# EAGLE design rizon_io (EAGLE 8.4.1)
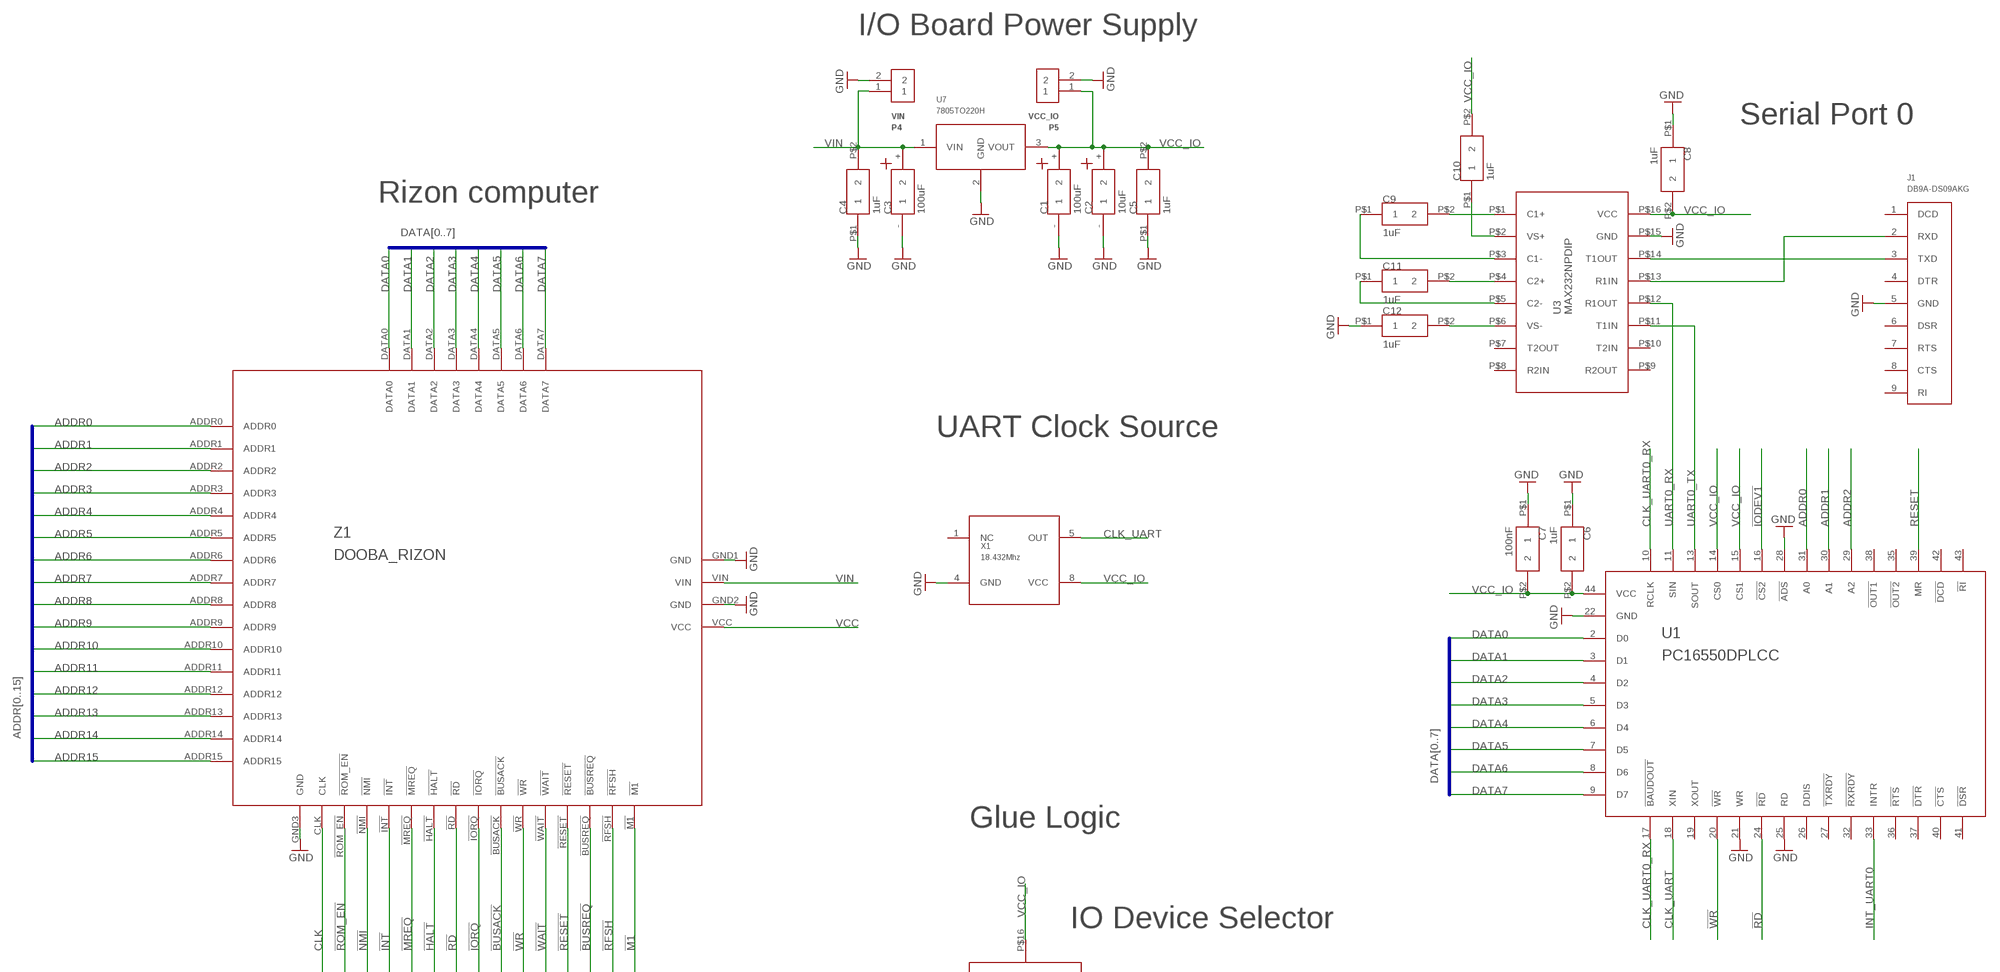
[diagram p0: schematic, sheet 1, part 1 of 3]
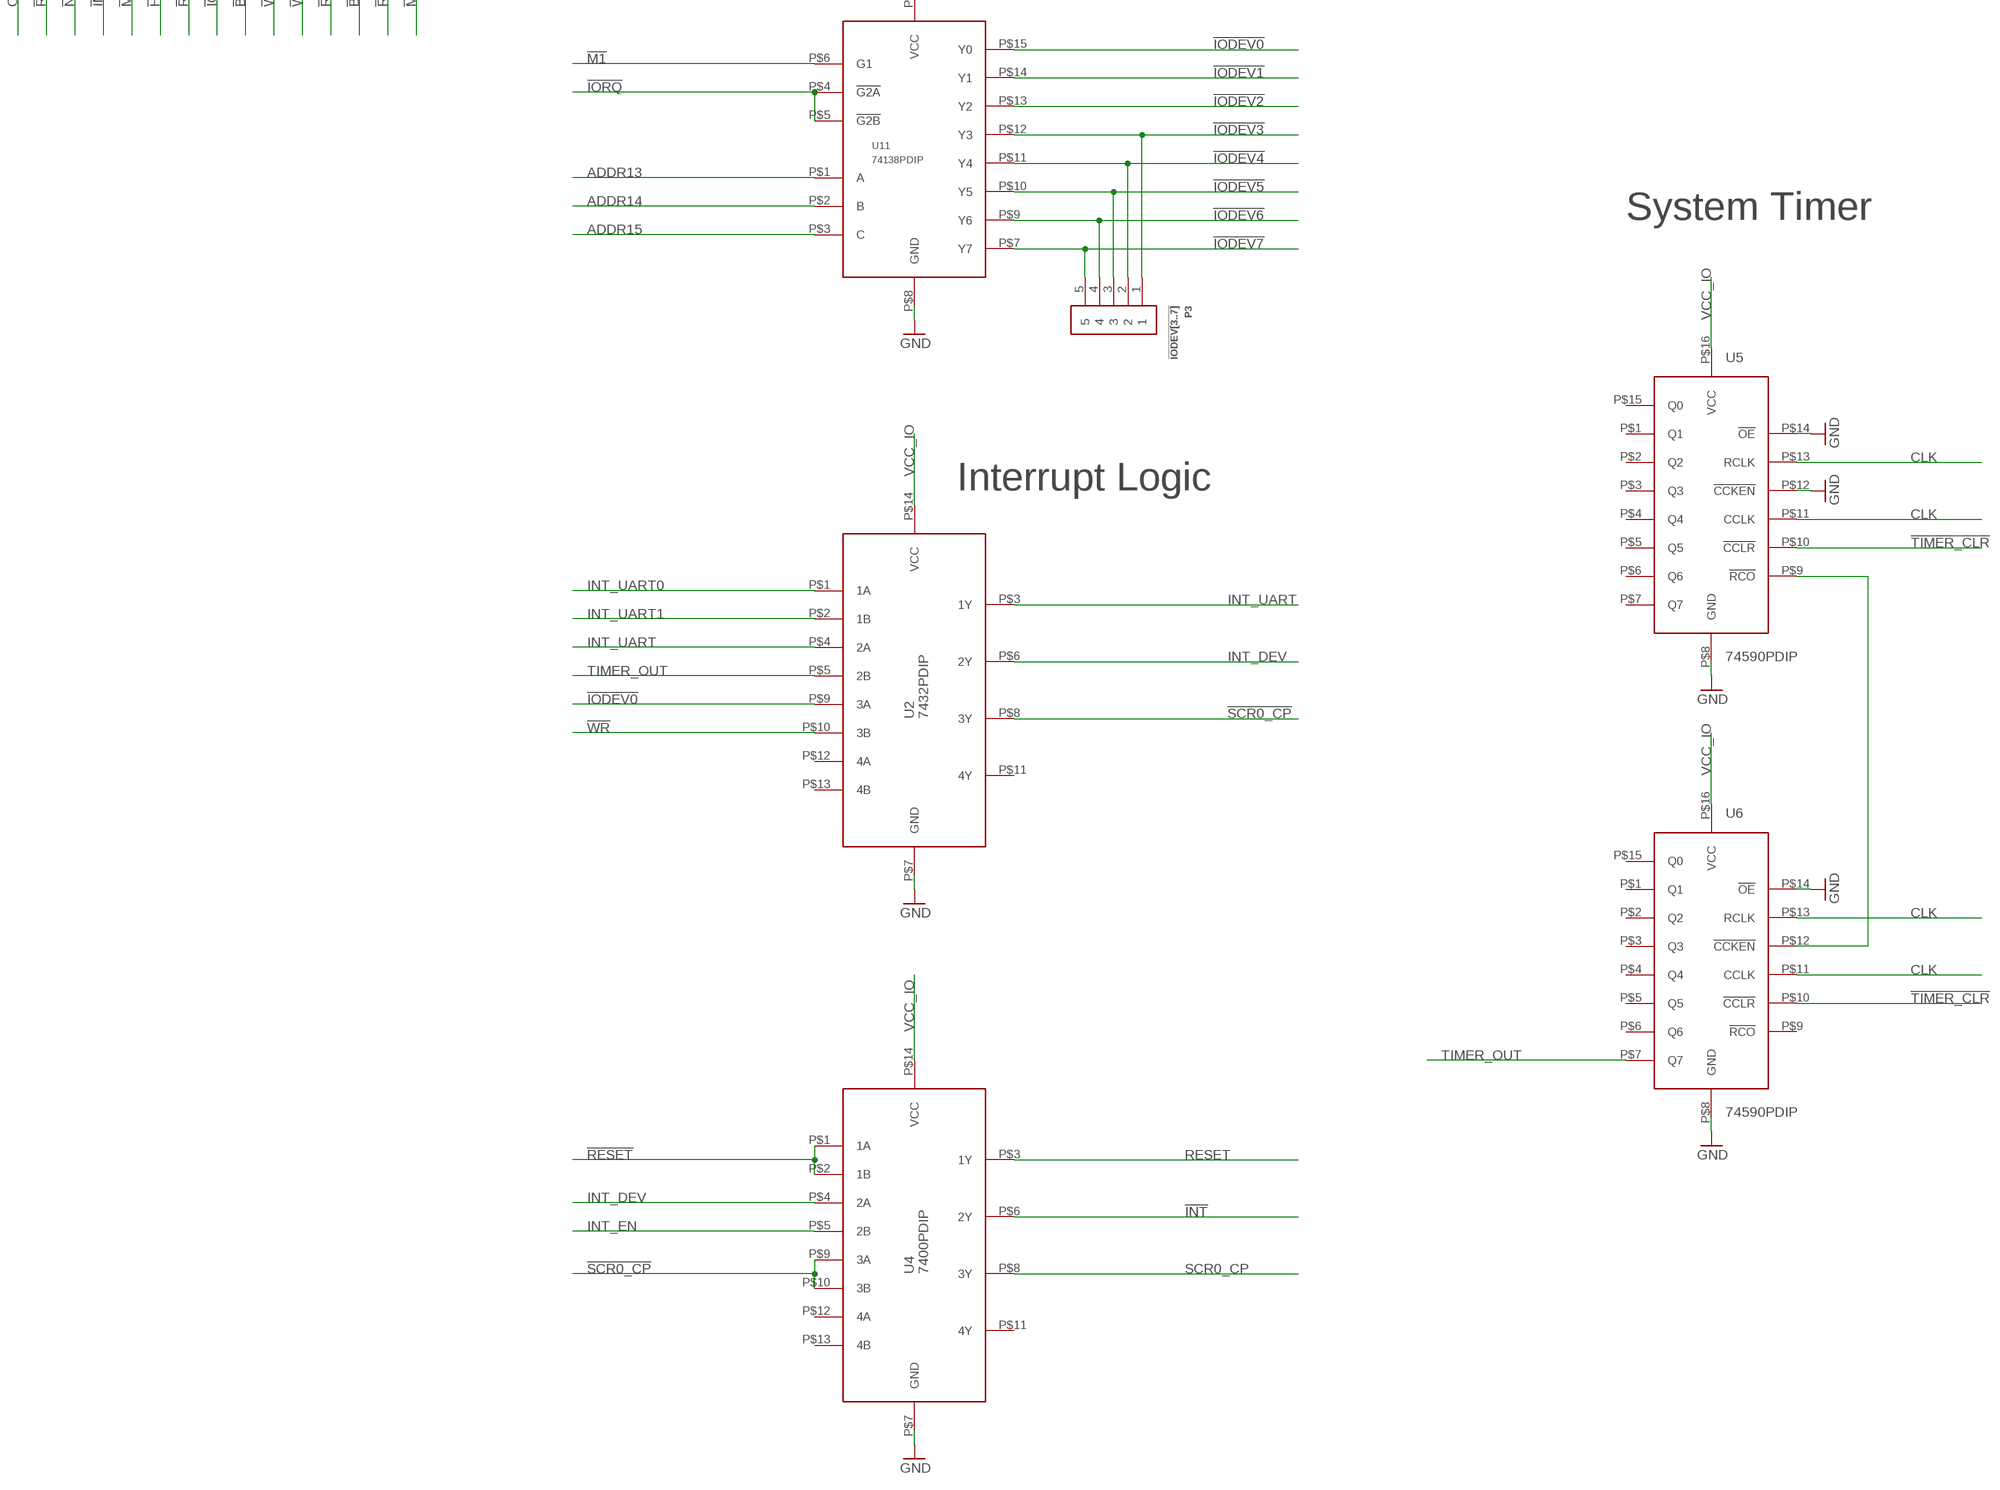
[diagram p1: schematic, sheet 1, part 2 of 3]
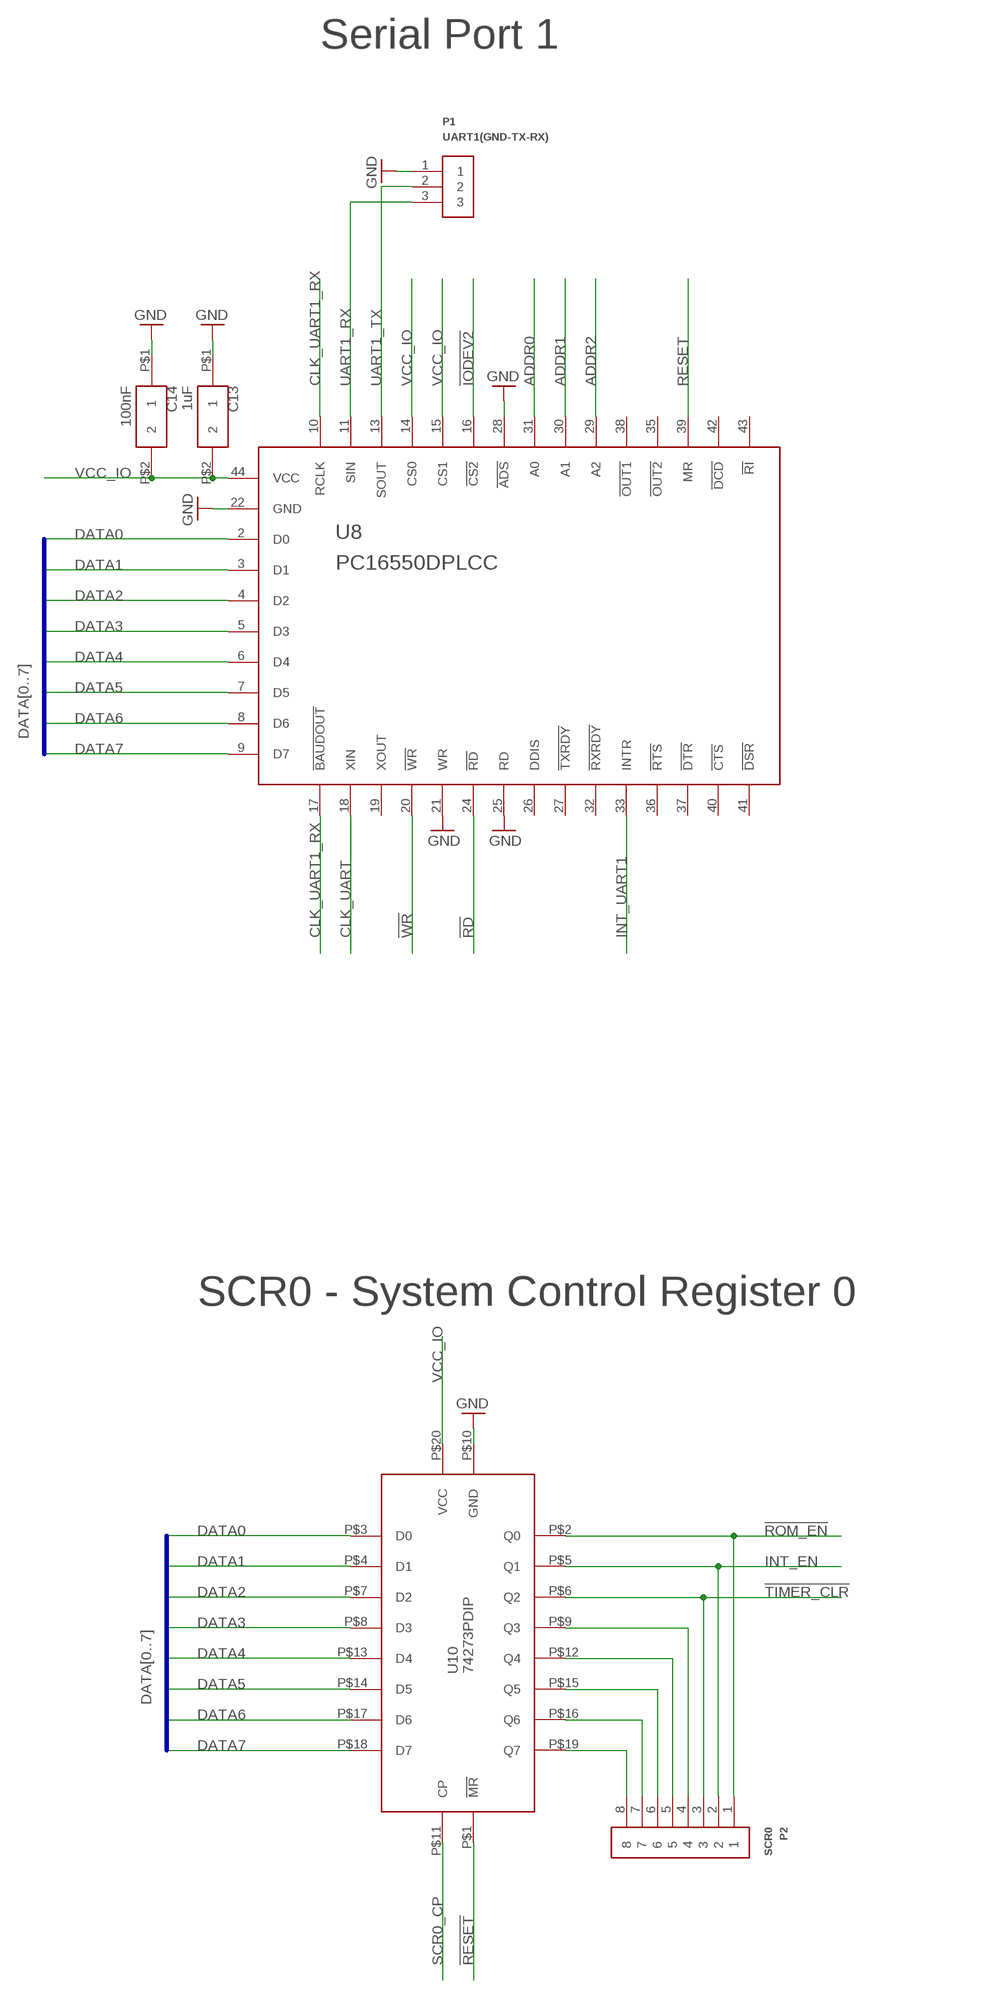
[diagram p2: schematic, sheet 1, part 3 of 3]

## Parts
C1  100uF  CAP_POLARIZEDRAD_5MM  [RADCAP_5MM]
C2  10uF  CAP_POLARIZEDRAD_5MM  [RADCAP_5MM]
C3  100uF  CAP_POLARIZEDRAD_5MM  [RADCAP_5MM]
C4  1uF  CAP508  [CAP_508]
C5  1uF  CAP508  [CAP_508]
C6  1uF  CAP508  [CAP_508]
C7  100nF  CAPDISC  [CAP_DISC]
C8  1uF  CAP508  [CAP_508]
C9  1uF  CAP508  [CAP_508]
C10  1uF  CAP508  [CAP_508]
C11  1uF  CAP508  [CAP_508]
C12  1uF  CAP508  [CAP_508]
C13  1uF  CAP508  [CAP_508]
C14  100nF  CAPDISC  [CAP_DISC]
J1  DB9A-DS09AKG  [A-DS09AKG]
P1  UART1(GND-TX-RX)  PIN_3  [PIN_3]
P2  SCR0  PIN_8  [PIN_8]
P3  !IODEV[3..7]  PIN_5  [PIN_5]
P4  VIN  PIN_2  [PIN_2]
P5  VCC_IO  PIN_2  [PIN_2]
U1  PC16550DPLCC  [PLCC-S44-SOCKET]
U2  7432PDIP  [PDIP14]
U3  MAX232NPDIP  [PDIP16]
U4  7400PDIP  [PDIP14]
U5  74590PDIP  [PDIP16]
U6  74590PDIP  [PDIP16]
U7  7805TO220H  [TO220H]
U8  PC16550DPLCC  [PLCC-S44-SOCKET]
U10  74273PDIP  [PDIP20]
U11  74138PDIP  [PDIP16]
X1  18.432Mhz  OSC412.7  [OSC127]
Z1  DOOBA_RIZON  [DOOBA_RIZON]

## Nets
!BUSACK: Z1.!BUSACK
!BUSREQ: Z1.!BUSREQ
!HALT: Z1.!HALT
!INT: U4.P$6(2Y) Z1.!INT
!IODEV0: U2.P$9(3A) U11.P$15(Y0)
!IODEV1: U1.16(!CS2) U11.P$14(Y1)
!IODEV2: U8.16(!CS2) U11.P$13(Y2)
!IODEV3: P3.1 U11.P$12(Y3)
!IODEV4: P3.2 U11.P$11(Y4)
!IODEV5: P3.3 U11.P$10(Y5)
!IODEV6: P3.4 U11.P$9(Y6)
!IODEV7: P3.5 U11.P$7(Y7)
!IORQ: U11.P$4(!G2A) U11.P$5(!G2B) Z1.!IORQ
!M1: U11.P$6(G1) Z1.!M1
!MREQ: Z1.!MREQ
!NMI: Z1.!NMI
!RD: U1.24(!RD) U8.24(!RD) Z1.!RD
!RESET: U4.P$1(1A) U4.P$2(1B) U10.P$1(!MR) Z1.!RESET
!RFSH: Z1.!RFSH
!ROM_EN: P2.1 U10.P$2(Q0) Z1.!ROM_EN
!SCR0_CP: U2.P$8(3Y) U4.P$9(3A) U4.P$10(3B)
!TIMER_CLR: P2.3 U5.P$10(!CCLR) U6.P$10(!CCLR) U10.P$6(Q2)
!WAIT: Z1.!WAIT
!WR: U1.20(!WR) U2.P$10(3B) U8.20(!WR) Z1.!WR
ADDR0: U1.31(A0) U8.31(A0) Z1.ADDR0
ADDR1: U1.30(A1) U8.30(A1) Z1.ADDR1
ADDR2: U1.29(A2) U8.29(A2) Z1.ADDR2
ADDR3: Z1.ADDR3
ADDR4: Z1.ADDR4
ADDR5: Z1.ADDR5
ADDR6: Z1.ADDR6
ADDR7: Z1.ADDR7
ADDR8: Z1.ADDR8
ADDR9: Z1.ADDR9
ADDR10: Z1.ADDR10
ADDR11: Z1.ADDR11
ADDR12: Z1.ADDR12
ADDR13: U11.P$1(A) Z1.ADDR13
ADDR14: U11.P$2(B) Z1.ADDR14
ADDR15: U11.P$3(C) Z1.ADDR15
CLK: U5.P$11(CCLK) U5.P$13(RCLK) U6.P$11(CCLK) U6.P$13(RCLK) Z1.CLK
CLK_UART: U1.18(XIN) U8.18(XIN) X1.5(OUT)
CLK_UART0_RX: U1.10(RCLK) U1.17(!BAUDOUT)
CLK_UART1_RX: U8.10(RCLK) U8.17(!BAUDOUT)
DATA0: U1.2(D0) U8.2(D0) U10.P$3(D0) Z1.DATA0
DATA1: U1.3(D1) U8.3(D1) U10.P$4(D1) Z1.DATA1
DATA2: U1.4(D2) U8.4(D2) U10.P$7(D2) Z1.DATA2
DATA3: U1.5(D3) U8.5(D3) U10.P$8(D3) Z1.DATA3
DATA4: U1.6(D4) U8.6(D4) U10.P$13(D4) Z1.DATA4
DATA5: U1.7(D5) U8.7(D5) U10.P$14(D5) Z1.DATA5
DATA6: U1.8(D6) U8.8(D6) U10.P$17(D6) Z1.DATA6
DATA7: U1.9(D7) U8.9(D7) U10.P$18(D7) Z1.DATA7
GND: C1.- C2.- C3.- C4.P$1 C5.P$1 C6.P$1 C7.P$1 C8.P$1 C12.P$1 C13.P$1 C14.P$1 J1.5(GND) P1.1 P4.2 P5.2 U1.21(WR) U1.22(GND) U1.25(RD) U1.28(!ADS) U2.P$7(GND) U3.P$15(GND) U4.P$7(GND) U5.P$8(GND) U5.P$12(!CCKEN) U5.P$14(!OE) U6.P$8(GND) U6.P$14(!OE) U7.2(GND) U8.21(WR) U8.22(GND) U8.25(RD) U8.28(!ADS) U10.P$10(GND) U11.P$8(GND) X1.4(GND) Z1.GND1(GND) Z1.GND2(GND) Z1.GND3(GND)
INT_DEV: U2.P$6(2Y) U4.P$4(2A)
INT_EN: P2.2 U4.P$5(2B) U10.P$5(Q1)
INT_UART: U2.P$3(1Y) U2.P$4(2A)
INT_UART0: U1.33(INTR) U2.P$1(1A)
INT_UART1: U2.P$2(1B) U8.33(INTR)
N$1: U5.P$9(!RCO) U6.P$12(!CCKEN)
N$2: C11.P$2 U3.P$4(C2+)
N$3: C11.P$1 U3.P$5(C2-)
N$4: C9.P$1 U3.P$3(C1-)
N$5: C9.P$2 U3.P$1(C1+)
N$6: C10.P$1 U3.P$2(VS+)
N$7: C12.P$2 U3.P$6(VS-)
N$8: J1.3(TXD) U3.P$14(T1OUT)
N$9: J1.2(RXD) U3.P$13(R1IN)
N$10: P2.8 U10.P$19(Q7)
N$11: P2.7 U10.P$16(Q6)
N$12: P2.6 U10.P$15(Q5)
N$13: P2.5 U10.P$12(Q4)
N$14: P2.4 U10.P$9(Q3)
RESET: U1.39(MR) U4.P$3(1Y) U8.39(MR)
SCR0_CP: U4.P$8(3Y) U10.P$11(CP)
TIMER_OUT: U2.P$5(2B) U6.P$7(Q7)
UART0_RX: U1.11(SIN) U3.P$12(R1OUT)
UART0_TX: U1.13(SOUT) U3.P$11(T1IN)
UART1_RX: P1.3 U8.11(SIN)
UART1_TX: P1.2 U8.13(SOUT)
VCC: Z1.VCC
VCC_IO: C1.+ C2.+ C5.P$2 C6.P$2 C7.P$2 C8.P$2 C10.P$2 C13.P$2 C14.P$2 P5.1 U1.14(CS0) U1.15(CS1) U1.44(VCC) U2.P$14(VCC) U3.P$16(VCC) U4.P$14(VCC) U5.P$16(VCC) U6.P$16(VCC) U7.3(VOUT) U8.14(CS0) U8.15(CS1) U8.44(VCC) U10.P$20(VCC) U11.P$16(VCC) X1.8(VCC)
VIN: C3.+ C4.P$2 P4.1 U7.1(VIN) Z1.VIN
Unconnected: J1.1(DCD) J1.4(DTR) J1.6(DSR) J1.7(RTS) J1.8(CTS) J1.9(RI) U1.19(XOUT) U1.26(DDIS) U1.27(!TXRDY) U1.32(!RXRDY) U1.35(!OUT2) U1.36(!RTS) U1.37(!DTR) U1.38(!OUT1) U1.40(!CTS) U1.41(!DSR) U1.42(!DCD) U1.43(!RI) U2.P$11(4Y) U2.P$12(4A) U2.P$13(4B) U3.P$7(T2OUT) U3.P$8(R2IN) U3.P$9(R2OUT) U3.P$10(T2IN) U4.P$11(4Y) U4.P$12(4A) U4.P$13(4B) U5.P$1(Q1) U5.P$2(Q2) U5.P$3(Q3) U5.P$4(Q4) U5.P$5(Q5) U5.P$6(Q6) U5.P$7(Q7) U5.P$15(Q0) U6.P$1(Q1) U6.P$2(Q2) U6.P$3(Q3) U6.P$4(Q4) U6.P$5(Q5) U6.P$6(Q6) U6.P$9(!RCO) U6.P$15(Q0) U8.19(XOUT) U8.26(DDIS) U8.27(!TXRDY) U8.32(!RXRDY) U8.35(!OUT2) U8.36(!RTS) U8.37(!DTR) U8.38(!OUT1) U8.40(!CTS) U8.41(!DSR) U8.42(!DCD) U8.43(!RI) X1.1(NC)

## Buses
DATA[0..7]
ADDR[0..15]

## Notes on the sheet
- I/O Board Power Supply
- Serial Port 0
- Rizon computer
- Serial Port 1
- UART Clock Source
- Glue Logic
- IO Device Selector
- System Timer
- SCR0 - System Control Register 0
- Interrupt Logic

## Library data of the parts
C1-C3 = dooba:CAP_POLARIZED
C4-C14 = dooba:CAP
J1 = dooba:DB9
P1 = dooba:PIN_3
P2 = dooba:PIN_8
P3 = dooba:PIN_5
P4 P5 = dooba:PIN_2
U1 U8 = dooba:PC16550D
U2 = dooba:7432
U3 = dooba:MAX232N
U4 = dooba:7400
U5 U6 = dooba:74590
U7 = dooba:7805
U10 = dooba:74273
U11 = dooba:74138
X1 = dooba:OSC4
Z1 = dooba:DOOBA_RIZON

## Board
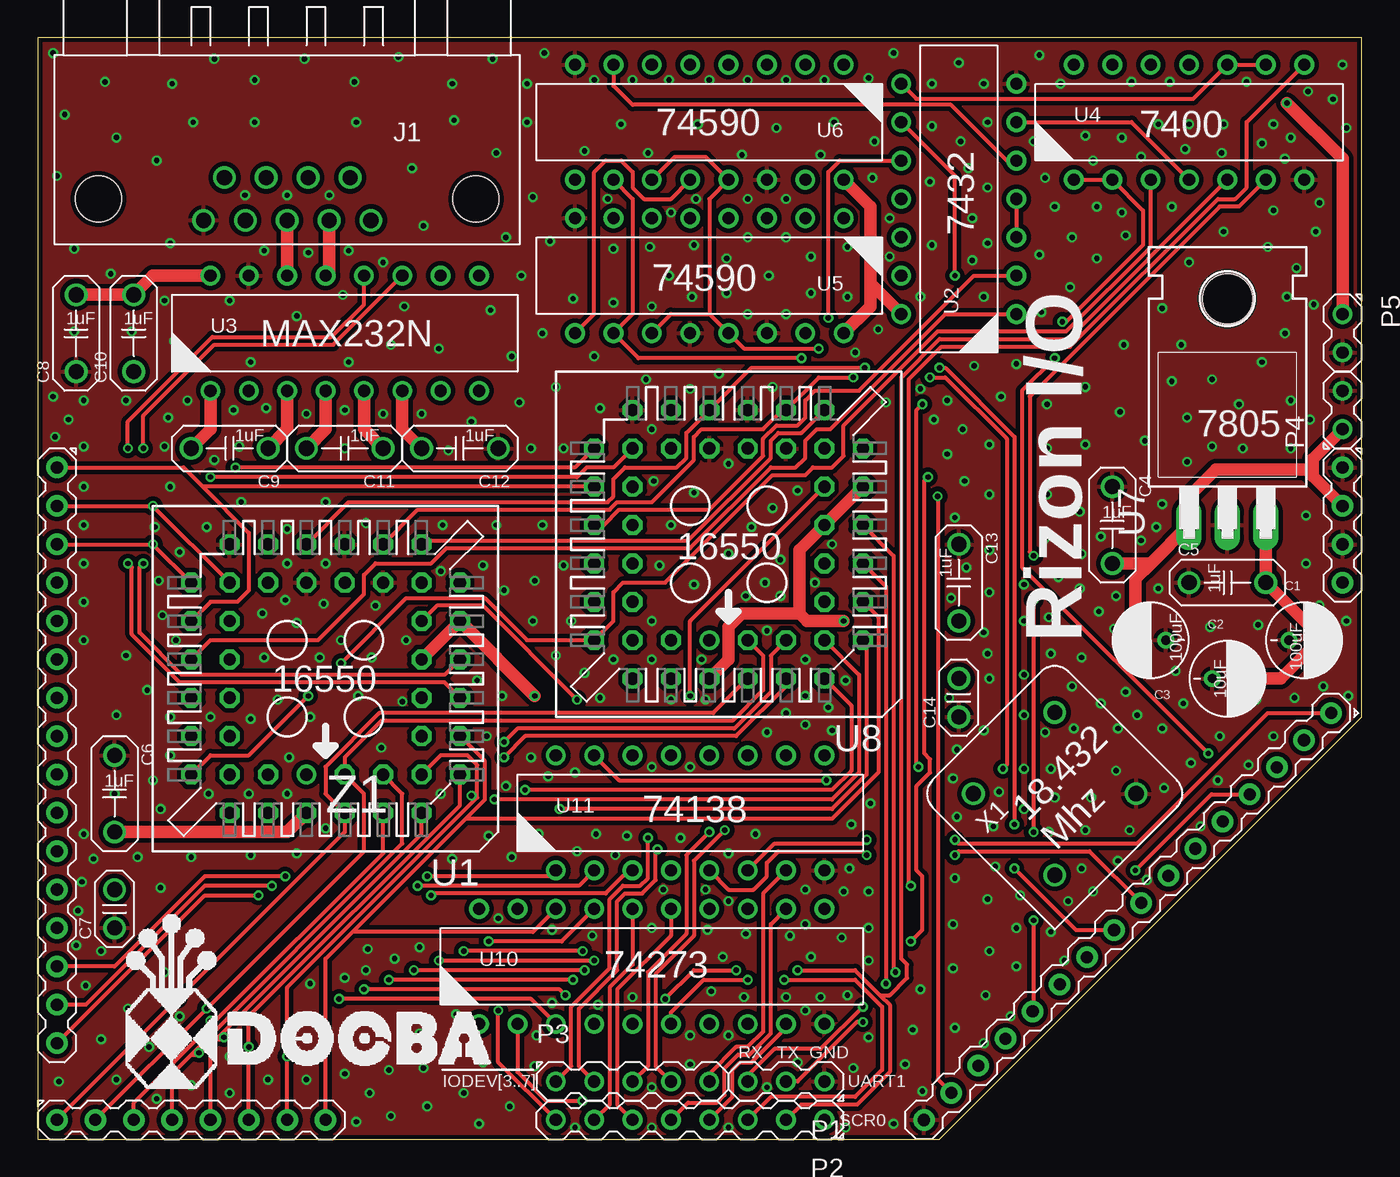
[diagram p3: board, top side]
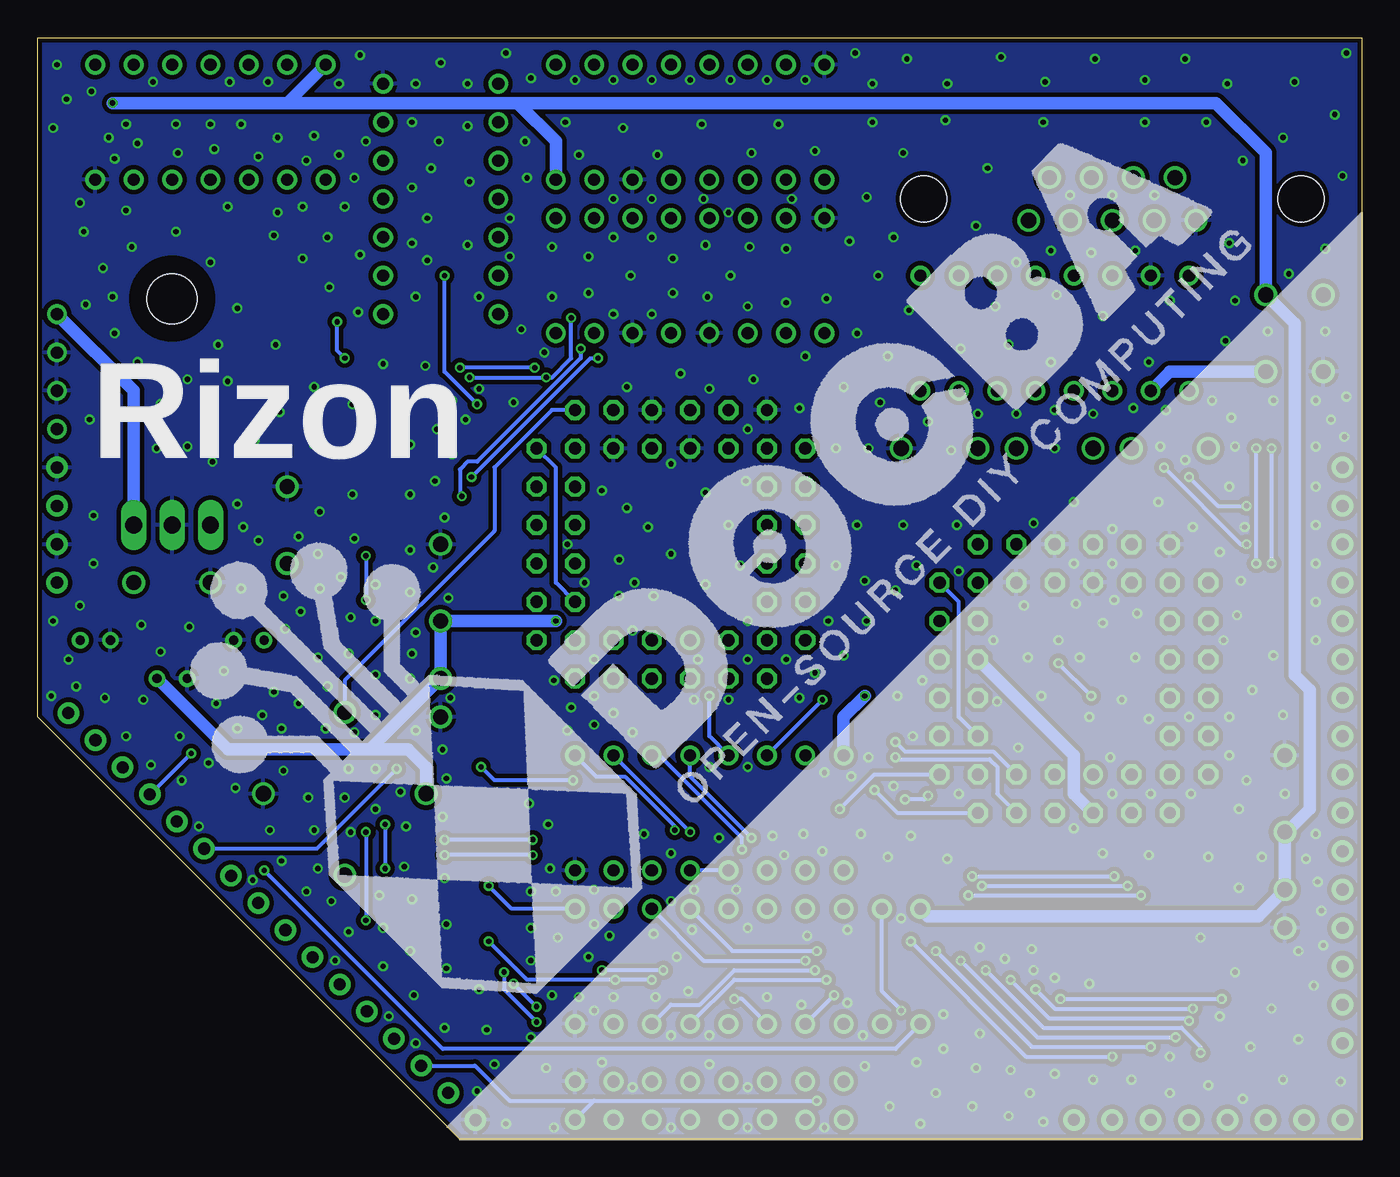
[diagram p4: board, bottom side, seen from below]

Size 87.63 x 72.9 mm. Coordinates in mm from the lower left corner, seen from the top.
Outline: 0,0 59.69,0 87.63,27.94 87.63,72.9 0,72.9 0,0
Copper layers (1*16): Top 0.035mm / dielectric 1.5mm / Bottom 0.035mm
Design rules "dooba": minimum track width 6mil, minimum drill 12mil, track to track 6mil, track to pad 6mil, pad to pad 6mil, via to via 6mil, smd to smd 0mil, copper to edge 10mil, drill to drill 10mil, minimum pad ring 10mil, minimum via ring 6mil, stop-mask expansion 2mil, vias tented up to drill 25mil, thermal gap 10mil

### Footprints (pad centres in the part's own frame; a part is rotated, then mirrored left to right if it is on the bottom)
RADCAP_5MM = drill 0.6: + 1,0; - -1,0
CAP_508 = drill 1: P$1 -2.54,0; P$2 2.54,0
CAP_DISC = drill 1: P$1 -1.27,0; P$2 1.27,0
A-DS09AKG = drill 1: 1 -5.54,1.42; 2 -2.77,1.42; 3 0,1.42; 4 2.77,1.42; 5 5.54,1.42; 6 -4.155,-1.42; 7 -1.385,-1.42; 8 1.385,-1.42; 9 4.155,-1.42 | hole 3.05: -12.495,0; 12.495,0
PIN_3 = drill 0.8: 1 -2.54,0; 2 0,0; 3 2.54,0
PIN_8 = drill 0.8: 1 -8.89,0; 2 -6.35,0; 3 -3.81,0; 4 -1.27,0; 5 1.27,0; 6 3.81,0; 7 6.35,0; 8 8.89,0
PIN_5 = drill 0.8: 1 -5.08,0; 2 -2.54,0; 3 0,0; 4 2.54,0; 5 5.08,0
PIN_2 = drill 0.8: 1 -1.27,0; 2 1.27,0
PLCC-S44-SOCKET = drill 0.813: 1 1.27,6.35 | drill 0.813 octagon: 2 -1.27,8.89; 3 -1.27,6.35; 4 -3.81,8.89; 5 -3.81,6.35; 6 -6.35,8.89; 7 -8.89,6.35; 8 -6.35,6.35; 9 -8.89,3.81; 10 -6.35,3.81; 11 -8.89,1.27; 12 -6.35,1.27; 13 -8.89,-1.27; 14 -6.35,-1.27; 15 -8.89,-3.81; 16 -6.35,-3.81; 17 -8.89,-6.35; 18 -6.35,-8.89; 19 -6.35,-6.35; 20 -3.81,-8.89; 21 -3.81,-6.35; 22 -1.27,-8.89; 23 -1.27,-6.35; 24 1.27,-8.89; 25 1.27,-6.35; 26 3.81,-8.89; 27 3.81,-6.35; 28 6.35,-8.89; 29 8.89,-6.35; 30 6.35,-6.35; 31 8.89,-3.81; 32 6.35,-3.81; 33 8.89,-1.27; 34 6.35,-1.27; 35 8.89,1.27; 36 6.35,1.27; 37 8.89,3.81; 38 6.35,3.81; 39 8.89,6.35; 40 6.35,8.89; 41 6.35,6.35; 42 3.81,8.89; 43 3.81,6.35; 44 1.27,8.89
PDIP14 = drill 0.8: P$1 -7.62,-3.81; P$2 -5.08,-3.81; P$3 -2.54,-3.81; P$4 0,-3.81; P$5 2.54,-3.81; P$6 5.08,-3.81; P$7 7.62,-3.81; P$8 7.62,3.81; P$9 5.08,3.81; P$10 2.54,3.81; P$11 0,3.81; P$12 -2.54,3.81; P$13 -5.08,3.81; P$14 -7.62,3.81
PDIP16 = drill 0.8: P$1 -8.89,-3.81; P$2 -6.35,-3.81; P$3 -3.81,-3.81; P$4 -1.27,-3.81; P$5 1.27,-3.81; P$6 3.81,-3.81; P$7 6.35,-3.81; P$8 8.89,-3.81; P$9 8.89,3.81; P$10 6.35,3.81; P$11 3.81,3.81; P$12 1.27,3.81; P$13 -1.27,3.81; P$14 -3.81,3.81; P$15 -6.35,3.81; P$16 -8.89,3.81
TO220H = drill 1.118 long: 1 -2.54,-10.16; 2 0,-10.16; 3 2.54,-10.16 | hole 3.302: 0,4.826
PDIP20 = drill 0.8: P$1 -11.43,-3.81; P$2 -8.89,-3.81; P$3 -6.35,-3.81; P$4 -3.81,-3.81; P$5 -1.27,-3.81; P$6 1.27,-3.81; P$7 3.81,-3.81; P$8 6.35,-3.81; P$9 8.89,-3.81; P$10 11.43,-3.81; P$11 11.43,3.81; P$12 8.89,3.81; P$13 6.35,3.81; P$14 3.81,3.81; P$15 1.27,3.81; P$16 -1.27,3.81; P$17 -3.81,3.81; P$18 -6.35,3.81; P$19 -8.89,3.81; P$20 -11.43,3.81
OSC127 = drill 1: 1 -3.81,-3.81; 4 3.81,-3.81; 5 3.81,3.81; 8 -3.81,3.81
DOOBA_RIZON = drill 0.8 pad 1.422: !BUSACK 74.83,17.426; !BUSREQ 82.014,24.61; !HALT 69.442,12.038; !INT 65.85,8.446; !IORQ 73.034,15.63; !M1 85.606,28.202; !MREQ 67.646,10.242; !NMI 64.054,6.65; !RD 71.238,13.834; !RESET 80.218,22.814; !RFSH 83.81,26.406; !ROM_EN 62.258,4.854; !WAIT 78.422,21.018; !WR 76.626,19.222; ADDR0 1.27,44.45; ADDR1 1.27,41.91; ADDR2 1.27,39.37; ADDR3 1.27,36.83; ADDR4 1.27,34.29; ADDR5 1.27,31.75; ADDR6 1.27,29.21; ADDR7 1.27,26.67; ADDR8 1.27,24.13; ADDR9 1.27,21.59; ADDR10 1.27,19.05; ADDR11 1.27,16.51; ADDR12 1.27,13.97; ADDR13 1.27,11.43; ADDR14 1.27,8.89; ADDR15 1.27,6.35; CLK 60.462,3.058; DATA0 1.27,1.27; DATA1 3.81,1.27; DATA2 6.35,1.27; DATA3 8.89,1.27; DATA4 11.43,1.27; DATA5 13.97,1.27; DATA6 16.51,1.27; DATA7 19.05,1.27; GND1 86.36,44.45; GND2 86.36,39.37; GND3 58.666,1.262; VCC 86.36,36.83; VIN 86.36,41.91

### Placement (x,y rotation side)
C1  83.82,33.02 0 top
C2  78.74,30.48 0 top
C3  73.66,33.02 180 top
C4  71.12,40.64 270 top
C5  78.74,36.83 0 top
C6  5.08,22.86 270 top
C7  5.08,15.24 90 top
C8  2.54,53.34 90 top
C9  12.7,45.72 180 top
C10  6.35,53.34 90 top
C11  20.32,45.72 180 top
C12  27.94,45.72 180 top
C13  60.96,36.83 270 top
C14  60.96,29.21 90 top
J1  16.51,62.23 180 top
P1  49.53,3.81 180 top
P2  43.18,1.27 180 top
P3  39.37,3.81 0 top
P4  86.36,48.26 90 top
P5  86.36,53.34 270 top
U1  19.05,30.48 180 top
U2  60.96,62.23 90 top
U3  20.32,53.34 0 top
U4  76.2,67.31 0 top
U5  44.45,57.15 180 top
U6  44.45,67.31 180 top
U7  78.74,50.8 0 top
U8  45.72,39.37 180 top
U10  40.64,11.43 0 top
U11  43.18,21.59 0 top
X1  67.31,22.86 45 top
Z1  0,0 0 top

### Tracks (layer width: path | path; a pad name or v marks a point on that pad's centre or on a via)
!INT  (via drill 0.35)
  Top 0.254: U4.P$6 79.5,61.72 78.23,61.72 65.66,49.15 65.66,38.86 v65.91,38.61 | v65.91,14.48 65.91,8.51 Z1.!INT | v65.91,35.69 v65.91,20.32
  Bottom 0.254: v65.91,38.61 v65.91,35.69 | v65.91,20.32 v65.91,14.48
!IODEV0  (via drill 0.35)
  Top 0.254: U11.P$15 38.48,23.75 v52.2,23.75 | v58.29,24.64 58.17,24.77 58.17,48.26 v58.55,48.64 | v60.71,57.15 60.71,63.75 U2.P$9
  Bottom 0.254: v52.2,23.75 57.4,23.75 v58.29,24.64 | v58.55,48.64 60.71,50.8 v60.71,57.15
!IODEV1  (via drill 0.35)
  Top 0.254: U1.16 26.42,35.31 29.46,35.31 v35.69,29.08
  Bottom 0.254: U11.P$14 v35.69,29.08
!IODEV2  (via drill 0.35)
  Top 0.254: v43.18,29.34 43.18,34.29 U8.16
  Bottom 0.254: U11.P$13 43.18,26.67 v43.18,29.34
!IODEV3  (via drill 0.35)
  Top 0.254: P3.1 35.31,4.83 35.31,8.76 37.85,11.3 37.85,15.88 38.73,16.76 39.88,16.76 40.39,17.27 v40.39,19.94
  Bottom 0.254: v40.39,19.94 44.45,24 U11.P$12
!IODEV4  (via drill 0.35)
  Top 0.254: P3.2 35.81,4.83 35.81,8.64 38.35,11.18 38.35,15.75 38.86,16.26 40.01,16.26 40.89,17.14 40.89,19.05 v41.02,19.18
  Bottom 0.254: v41.02,19.18 41.02,19.94 46.48,25.4 U11.P$11
!IODEV5  (via drill 0.35)
  Top 0.254: v44.45,20.32 42.93,18.8 42.93,13.59 40.39,11.05 40.39,4.83 P3.3
  Bottom 0.254: U11.P$10 v44.45,20.32
!IODEV6  (via drill 0.35)
  Top 0.254: v45.47,20.45 43.43,18.41 43.43,13.46 40.89,10.92 40.89,4.83 P3.4
  Bottom 0.254: U11.P$9 50.67,24 48.77,24 45.47,20.7 v45.47,20.45
!IODEV7
  Top 0.254: U11.P$7 48.01,16.26 48.01,7.11 46.99,6.1 46.23,6.1 44.45,4.32 P3.5
!IORQ  (via drill 0.35)
  Top 0.254: U11.P$5 45.72,16.51 47.37,16.51 48.26,17.4 48.26,18.29 49.02,19.05 54.61,19.05 v54.86,18.8 | v60.71,18.8 60.96,19.05 69.61,19.05 Z1.!IORQ
  Bottom 0.254: U11.P$4 U11.P$5 | v54.86,18.8 v60.71,18.8
!M1  (via drill 0.35)
  Top 0.254: U11.P$6 48.77,19.56 54.61,19.56 v54.86,19.81 | v60.71,19.81 60.96,19.56 72.77,19.56 81.41,28.19 85.6,28.19 Z1.!M1
  Bottom 0.254: v54.86,19.81 v60.71,19.81
!RD  (via drill 0.35)
  Top 0.254: U1.24 20.57,42.16 37.72,42.16 38.1,42.55 38.1,43.69 38.86,44.45 42.29,44.45 42.93,45.09 42.93,46.74 U8.24 47.24,51.05 v54.74,51.05 | v59.69,51.05 60.07,51.05 64.64,46.48 v64.64,20.83 | v64.64,17.91 68.72,13.83 Z1.!RD
  Bottom 0.254: v54.74,51.05 v59.69,51.05 | v64.64,20.83 v64.64,17.91
!RESET  (via drill 0.35)
  Top 0.254: v72.64,17.78 77.68,22.81 Z1.!RESET | U4.P$1 U4.P$2 73.15,61.47 73.15,59.18 68.07,54.1 v67.82,54.1 | v67.31,51.69 65.15,49.53 65.15,37.85 v77.47,25.53
  Bottom 0.254: U10.P$1 30.86,5.97 60.83,5.97 v72.64,17.78 | v77.47,25.53 80.18,22.81 Z1.!RESET | v67.31,51.69 67.82,52.2 v67.82,54.1
!ROM_EN  (via drill 0.35)
  Top 0.254: U10.P$2 31.75,4.45 33.66,2.54 v36.07,2.54
  Bottom 0.254: 50.8,2.54 v36.07,2.54 | 50.8,2.54 P2.1 | Z1.!ROM_EN 58.7,4.85 56.39,2.54 50.8,2.54
!SCR0_CP
  Top 0.254: U4.P$9 U4.P$10 76.48,68.86 58.14,68.86 U2.P$8
!TIMER_CLR  (via drill 0.35)
  Top 0.254: U10.P$6 41.91,8.38 44.07,10.54 v46.99,10.54 | v49.4,10.54 54.1,10.54 55.88,8.76 55.88,4.57 54.1,2.79 48.51,2.79 P2.3 | U6.P$10 39.37,62.23 39.37,54.61 U5.P$10 39.75,51.69 v50.55,51.69 | v57.78,13.08 58.55,13.84 58.55,17.4 58.17,17.78 58.17,23.37 59.05,24.26 59.05,25.15 58.67,25.53 58.67,43.56 v58.93,43.81
  Bottom 0.254: v46.99,10.54 v49.4,10.54 55.24,10.54 v57.78,13.08 | v58.93,43.81 51.05,51.69 v50.55,51.69
!WR  (via drill 0.35)
  Top 0.254: U1.20 25.15,41.66 37.85,41.66 38.35,42.16 40.64,42.16 43.43,44.96 43.43,46.48 43.94,46.99 48.01,46.99 49.28,48.26 U8.20 51.69,50.42 v53.98,50.42 | v59.05,50.42 60.07,50.42 64.14,46.35 64.14,24.77 v63.88,24.51 | v52.32,54.36 52.32,64.01 53.09,64.77 U2.P$10
  Bottom 0.254: v59.05,50.42 v53.98,50.42 53.59,50.42 52.32,51.69 v52.32,54.36 | v63.88,24.51 69.17,19.22 Z1.!WR
ADDR0
  Top 0.254: Z1.ADDR0 9.65,44.45 10.92,43.18 | 10.92,43.18 13.97,40.13 13.97,36.32 13.21,35.56 11.43,35.56 U1.31 | U8.31 10.92,43.18
ADDR1  (via drill 0.35)
  Top 0.254: Z1.ADDR1 v7.62,41.91 U1.30 | U8.30 38.1,44.45 36.32,44.45 35.69,43.81 v11.43,43.81
  Bottom 0.254: v11.43,43.81 9.53,41.91 v7.62,41.91
ADDR2  (via drill 0.35)
  Top 0.254: Z1.ADDR2 v7.62,39.37 U1.29 | U8.29 35.56,44.45 v13.08,44.45
  Bottom 0.254: v13.08,44.45 8,39.37 v7.62,39.37
ADDR13  (via drill 0.35)
  Top 0.254: U11.P$1 33.91,17.4 v25.78,17.4 | v16.38,17.4 11.05,17.4 5.08,11.43 Z1.ADDR13
  Bottom 0.254: v25.78,17.4 v16.38,17.4
ADDR14  (via drill 0.35)
  Top 0.254: U11.P$2 35.81,16.76 v25.15,16.76 | v15.49,16.76 11.05,16.76 3.17,8.89 Z1.ADDR14
  Bottom 0.254: v25.15,16.76 v15.49,16.76
ADDR15  (via drill 0.35)
  Top 0.254: U11.P$3 39.12,17.78 37.59,16.26 26.16,16.26 v26.04,16.13 | Z1.ADDR15 11.05,16.13 v14.61,16.13
  Bottom 0.254: v26.04,16.13 v14.61,16.13
CLK  (via drill 0.35)
  Top 0.254: U6.P$11 42.16,65.02 44.2,65.02 U6.P$13 44.45,62.23 44.45,54.61 | 44.45,54.61 U5.P$13 46.74,52.32 v51.69,52.32 | U5.P$11 41.91,54.61 44.45,54.61 | Z1.CLK 59.56,3.96 v59.56,42.55
  Bottom 0.254: v51.69,52.32 51.69,51.69 58.55,44.83 59.18,44.83 59.69,44.32 59.69,42.67 v59.56,42.55
CLK_UART
  Top 0.254: U1.18 25.65,39.62 43.05,39.62 48.51,45.09 48.51,46.23 49.02,46.74 50.55,46.74 U8.18
  Bottom 0.254: U8.18 53.59,48.26 57.4,44.45 57.4,40.26 67.31,30.35 X1.5
CLK_UART0_RX
  Bottom 0.254: U1.10 26.67,27.94 26.67,35.56 U1.17
CLK_UART1_RX
  Bottom 0.254: U8.10 53.34,36.83 53.34,44.45 U8.17
DATA0  (via drill 0.35)
  Top 0.254: Z1.DATA0 v9.27,9.27 20.32,20.32 U1.2 19.05,22.86 19.05,24.64 22.61,28.19 44.7,28.19 U8.2 | U10.P$3 32.64,9.27 v19.94,9.27
  Bottom 0.254: v19.94,9.27 v9.27,9.27
DATA1  (via drill 0.35)
  Top 0.254: Z1.DATA1 v11.18,8.64 21.59,19.05 21.59,22.86 U1.3 20.32,25.27 22.73,27.69 45.97,27.69 48.01,29.72 48.01,32 U8.3 | v34.92,9.53 34.54,9.91 v21.59,9.91
  Bottom 0.254: U10.P$4 v34.92,9.53 | v21.59,9.91 20.32,8.64 v11.18,8.64
DATA2  (via drill 0.35)
  Top 0.254: Z1.DATA2 6.35,2.41 11.62,7.68 | U1.4 22.86,18.92 11.62,7.68 | U8.4 49.53,29.97 46.23,26.67 32.26,26.67 v30.86,25.27 | v35.43,10.54 v23.24,10.54 | v11.43,7.83 11.57,7.68 11.62,7.68
  Bottom 0.254: v30.86,25.27 30.73,25.15 24.64,25.15 24.13,24.64 24.13,22.86 U1.4 | U10.P$7 41.53,10.54 v35.43,10.54 | v23.24,10.54 20.7,8 11.56,8 11.43,7.87 v11.43,7.83
DATA3  (via drill 0.35)
  Top 0.254: Z1.DATA3 8.89,4.32 10.16,5.59 | U1.5 24.13,22.86 24.13,19.56 10.16,5.59 | U8.5 48.51,32 48.51,29.59 46.1,27.18 31.75,27.18 v30.86,26.29 | v36.2,11.18 v24.89,11.18 | 10.16,5.59 10.54,5.59 v10.67,5.71
  Bottom 0.254: v30.86,26.29 30.23,25.65 24.38,25.65 U1.5 | U10.P$8 45.72,8.89 43.81,8.89 41.53,11.18 v36.2,11.18 | v24.89,11.18 21.08,7.37 11.94,7.37 10.67,6.1 v10.67,5.71
DATA4  (via drill 0.35)
  Top 0.254: Z1.DATA4 11.43,6.22 11.81,6.6 | U1.6 25.4,20.19 11.81,6.6 | U8.6 53.85,28.7 53.85,24.38 52.58,23.11 v32.26,23.11 | v36.83,11.81 v26.54,11.81 | 11.81,6.6 12.19,6.6 v12.32,6.73
  Bottom 0.254: v32.26,23.11 30.73,21.59 U1.6 | U10.P$13 43.56,11.81 v36.83,11.81 | v26.54,11.81 21.46,6.73 v12.32,6.73
DATA5  (via drill 0.35)
  Top 0.254: Z1.DATA5 v13.97,6.1 13.97,8.13 27.94,22.1 U1.7 | U8.7 54.86,32.77 54.86,24.13 52.58,21.84 v34.54,21.84 | v36.07,12.45 v28.19,12.45
  Bottom 0.254: v34.54,21.84 32.26,24.13 U1.7 | U10.P$14 41.66,12.45 v36.07,12.45 | v28.19,12.45 21.84,6.1 v13.97,6.1
DATA6  (via drill 0.35)
  Top 0.254: Z1.DATA6 v16.51,5.46 16.51,10.03 29.08,22.61 | U1.8 26.67,25.4 28.45,25.4 29.08,24.77 29.08,22.61 | U8.8 54.36,30.73 54.36,24.26 52.58,22.48 v30.23,22.48 | 29.08,22.61 28.83,22.61 v28.7,22.73 | U10.P$17 34.67,13.08 v29.84,13.08
  Bottom 0.254: v30.23,22.48 28.96,22.48 v28.7,22.73 | v29.84,13.08 22.23,5.46 v16.51,5.46
DATA7
  Top 0.254: Z1.DATA7 19.05,11.94 20.83,13.72 | U1.9 29.59,25.02 29.59,22.48 28.32,21.21 | 20.83,13.72 28.32,21.21 | U8.9 55.63,34.54 55.63,24.26 52.58,21.21 28.32,21.21 | U10.P$18 32.77,13.72 20.83,13.72
GND  (via drill 0.35)
  other vias: 1.02,71.88 5.21,66.29 8.89,69.85 10.29,67.31 7.87,64.77 32.38,69.85 20.95,69.98 14.35,70.1 27.43,69.85 14.35,67.31 21.08,67.31 27.56,67.44 32.38,67.31 4.45,69.98 17.65,71.5 11.68,71.5 23.88,71.63 30.1,71.5 24.77,64.26 30.35,65.28 1.78,67.82 1.27,63.75 2.41,58.93 8.76,59.31 16.51,62.48 19.3,62.48 13.72,62.48 17.91,58.67 14.99,58.8 20.57,58.8 22.86,58.04 20.19,55.88 25.53,60.45 30.99,59.69 32.77,62.36 32,57.15 24.26,55.12 29.97,54.86 26.54,52.32 31.37,51.82 35.43,55.63 38.1,58.93 38.1,55.37 40.51,59.05 43.31,55.75 43.43,59.18 40.64,55.12 41.78,57.15 37.72,62.23 40.39,65.28 36.2,65.41 38.61,67.18 46.61,65.15 43.69,67.18 52.7,67.31 51.82,65.15 48.9,66.93 49.53,62.23 46.99,62.23 55.24,63.63 55.37,66.04 59.05,63.37 59.18,59.18 58.42,55.75 56.39,60.96 56.39,58.42 55.63,53.59 54.1,52.07 53.59,55.75 53.59,59.05 46.99,59.69 49.53,59.69 49.53,54.61 46.99,54.61 48.39,57.15 45.59,58.29 45.59,56.01 51.18,58.42 51.18,56.01 33.91,59.44 4.83,57.28 2.41,53.47 6.22,53.47 8.38,55.5 12.7,55.5 17.14,54.48 9.02,52.83 14.1,51.44 20.57,51.44 23.37,52.58 2.03,47.62 3.05,48.9 3.05,45.85 1.02,49.15 1.14,46.48 5.84,48.9 9.91,48.9 8.38,45.85 8.64,47.75 12.95,48.26 15.11,48.39 11.68,44.96 13.34,45.85 17.78,48.01 20.32,45.72 20.32,48.26 22.86,48.01 25.4,48.01 3.05,43.18 8.76,43.18 11.18,40.51 7.75,40.51 3.05,40.64 16.51,40.39 13.46,42.16 19.05,42.16 21.72,40.77 19.05,38.1 16.51,38.1 26.8,40.64 33.4,40.64 30.35,40.64 29.46,37.97 34.8,37.97 35.31,34.29 32.77,34.29 32.89,36.96 30.86,36.32 41.15,37.97 40.64,34.29 43.43,36.7 26.67,37.59 22.35,35.31 24.38,33.02 22.1,31.88 20.07,33.02 18.67,31.88 14.99,31.88 14.86,34.8 18.92,35.43 17.14,34.16 16.38,35.69 8,36.96 9.14,33.02 8.26,34.67 9.4,38.86 3.05,38.1 3.05,35.56 3.05,33.02 5.84,32 33.4,53.34 36.83,51.82 45.09,50.67 43.18,49.66 40.26,50.29 37.21,48.39 34.8,45.72 32.64,45.72 28.7,47.5 27.18,45.59 31.88,48.77 34.29,49.78 40.64,46.99 48.64,49.78 40.77,43.56 45.72,44.7 43.43,42.8 41.91,40.64 50.29,42.93 47.24,40.51 48.13,36.83 52.58,39.37 51.44,36.83 49.15,35.94 49.15,38.35 46.86,35.94 45.72,38.73 48.64,41.78 43.94,31.75 48.26,33.66 50.8,31.75 53.47,30.35 50.8,29.34 52.58,27.05 48.26,26.92 50.8,27.43 52.32,28.57 49.53,28.19 44.2,29.08 41.91,29.08 40.64,31.75 38.1,31.75 34.29,32 37.21,29.21 36.2,30.86 29.08,30.35 30.73,29.34 24.13,28.96 21.21,29.34 16.64,25.27 18.03,27.94 15.88,29.08 14.1,27.81 11.43,27.94 8.76,27.94 8.76,25.4 5.21,28.07 7.24,29.72 5.08,22.86 8.13,21.84 11.3,22.86 13.97,22.86 16.51,22.86 26.67,22.86 7.62,23.75 22.73,25.91 29.72,26.67 30.99,23.37 32.64,25.27 35.56,24.26 33.78,24 40.64,24.64 43.18,24.64 55.12,22.23 53.85,20.83 47.5,20.19 45.72,18.92 42.55,19.94 27.43,18.54 38.99,20.07 35.69,19.05 33.15,20.19 29.84,20.07 31.37,18.67 44.2,16.51 45.72,15.75 44.32,13.84 46.86,13.59 50.8,16.51 53.72,17.91 54.99,16.38 54.99,13.97 53.34,16.38 54.99,11.81 49.78,13.46 51.18,12.06 53.21,13.34 50.8,14.22 45.34,12.06 39.37,9.4 40.64,13.97 41.4,16.51 46.74,9.4 50.8,8.51 53.59,9.53 49.53,9.4 51.82,9.4 36.7,13.46 38.23,18.8 36.96,20.19 30.48,14.61 34.04,13.84 18.03,10.29 20.32,10.67 21.84,12.57 25.27,12.7 23.62,11.94 21.72,11.18 19.05,20.57 17.14,18.92 14.1,18.8 10.16,18.67 6.6,18.67 8.13,16.64 3.05,20.19 3.68,18.54 2.67,15.11 2.92,17.02 4.19,12.45 2.54,12.83 10.67,13.34 4.19,6.6 5.97,8.64 8.38,11.05 1.4,3.81 5.21,3.94 7.37,6.1 9.4,8.13 7.87,2.67 10.16,3.56 12.7,5.46 12.7,3.05 15.24,3.94 17.78,3.94 20.32,4.32 21.08,1.14 23.24,4.57 23.37,1.52 21.97,3.05 25.27,6.99 27.69,8.26 25.53,4.7 27.69,5.97 25.78,2.16 28.19,3.05 31.24,2.16 29.46,5.08 29.21,1.02 32.89,4.83 33.02,6.86 34.04,9.02 37.08,8.89 43.18,4.95 43.18,6.86 45.72,6.86 50.29,5.08 48.26,3.43 44.58,9.78 40.64,3.43 40.64,0.76 45.72,0.76 35.56,0.76 53.47,0.76 56.64,1.02 53.98,4.7 57.4,4.95 58.55,3.17 58.42,9.91 57.91,7.24 54.99,6.73 62.61,6.35 64.39,8.13 64.77,11.43 60.71,7.37 62.74,9.53 65.02,16.13 63.37,18.03 60.71,17.27 60.58,14.22 60.58,11.3 62.99,12.45 62.87,15.88 64.77,13.97 67.06,13.72 67.94,11.81 69.09,17.91 68.2,15.75 69.85,16.38 71.5,18.41 73.41,17.14 72.26,20.45 69.34,20.45 66.93,20.32 67.06,24.51 76.33,24.89 74.55,23.24 71.37,24.38 69.72,22.61 67.31,22.61 63.25,20.7 60.83,21.34 63.63,22.99 60.83,25.78 60.58,23.88 62.61,27.05 62.61,33.53 62.99,30.48 62.87,32.13 66.67,26.92 68.58,27.18 74.42,27.18 71.5,27.18 72.01,29.59 66.93,34.54 67.06,32.13 68.45,29.97 69.09,31.88 70.36,28.83 72.77,28.07 76.96,20.7 78.11,23.75 80.14,24.77 81.79,26.67 78.23,26.67 80.64,29.08 83.19,29.21 86.74,29.34 85.6,31.75 85.09,29.97 86.61,34.29 84.84,35.31 83.95,38.1 83.95,41.27 80.77,34.04 77.6,33.91 79.5,32.26 75.82,28.83 75.31,30.99 71.25,33.78 71.37,35.94 68.96,36.45 70.23,34.92 74.17,36.45 73.03,39.62 74.04,40.51 74.42,42.04 70.36,39.88 69.09,38.73 67.56,37.21 66.67,39.75 60.45,35.81 60.33,29.21 62.99,36.2 61.47,37.85 62.99,38.99 60.71,41.15 62.99,42.67 58.42,49.66 60.2,48.9 59.31,47.62 62.99,45.97 60.2,45.34 61.21,46.99 56.13,48.77 61.34,43.56 61.98,51.18 64.77,51.31 63.75,49.15 66.8,48.64 66.8,45.72 66.8,42.67 68.96,41.53 69.34,45.97 69.34,49.78 71.88,52.58 71.63,48.13 79.76,45.72 76.07,44.83 77.72,45.85 79.5,48.64 81.03,51.44 76.07,47.75 77.72,50.29 75.69,52.58 75.06,50.16 73.28,46.23 82.93,45.72 82.93,48.9 84.2,47.62 82.55,53.34 84.45,55.24 74.42,54.99 76.2,58.04 78.49,60.07 81.79,61.47 81.41,59.05 83.31,57.66 82.68,55.75 84.58,60.07 84.84,61.98 81.79,67.18 82.55,64.9 81.03,65.91 82.93,66.29 75.06,61.72 78.36,65.28 78.49,67.18 76.2,67.18 74.17,67.18 75.95,65.53 73.03,65.02 71.75,66.29 65.91,66.04 69.34,66.42 69.85,64.77 67.69,65.15 74.93,69.98 72.39,69.98 80.01,69.98 84.07,69.34 86.61,66.93 86.36,71.12 85.72,68.83 67.69,69.85 66.29,71.75 62.61,69.85 59.18,69.85 60.96,71.25 59.18,67.06 62.87,67.31 61.59,64.26 61.09,66.04 61.85,58.17 62.87,62.99 62.87,59.31 61.85,60.96 66.67,63.63 70.1,61.72 72.01,59.82 71.75,61.34 67.31,61.72 66.42,54.74 66.29,58.55 68.33,56.39 70.1,58.29 68.45,59.69 62.61,55.75 56.64,71.88 54.99,70.23 49.53,70.1 46.99,70.1 41.78,70.1 39.37,70.1 44.45,70.1 52.07,70.1 36.83,70.1 33.53,71.88 43.56,62.23 41.91,61.34 3.17,10.16 65.28,30.73 65.28,24.51 65.28,21.84 65.28,28.07 65.28,34.29 65.28,36.7
  pour Bottom (isolate 0.305): 0,0 59.69,0 87.63,27.94 87.63,72.9 0,72.9
  pour Top (isolate 0.305): 0,0 59.69,0 87.63,27.94 87.63,72.9 0,72.9
INT_DEV
  Top 0.254: U2.P$6 72.39,67.31 U4.P$4
INT_EN  (via drill 0.35)
  Top 0.254: v41.53,9.27 43.43,11.18 v46.23,11.18 | v50.29,11.18 54.1,11.18 55.75,9.53 | P2.2 50.55,2.29 54.23,2.29 56.39,4.45 56.39,8.89 55.75,9.53 | 55.75,9.53 56.39,9.53 57.53,10.67 57.53,11.56 57.15,11.94 57.15,50.42 59.69,52.96 68.2,52.96 U4.P$5
  Bottom 0.254: U10.P$5 41.02,9.27 v41.53,9.27 | v46.23,11.18 v50.29,11.18
INT_UART
  Top 0.254: U2.P$4 U2.P$3
INT_UART0
  Top 0.254: U1.33 11.43,33.02 18.54,33.02 21.59,36.07 21.59,37.34 22.35,38.1 26.04,38.1 27.05,39.12 43.18,39.12 48.51,44.45 50.16,44.45 50.8,45.09 50.8,46.23 51.56,46.99 52.45,46.99 60.07,54.61 U2.P$1
INT_UART1
  Top 0.254: U2.P$2 61.98,57.15 54.36,49.53 51.44,49.53 50.8,48.9 50.8,47.75 50.29,47.24 48.9,47.24 48.01,46.35 48.01,45.21 44.45,41.66 38.48,41.66 37.47,40.64 U8.33
N$1
  Top 0.254: U5.P$9 36.83,54.61 36.83,64.01 37.59,64.77 38.61,64.77 39.37,64.01 39.37,62.99 40.13,62.23 41.91,62.23 U6.P$12
N$2
  Top 0.813: U3.P$4 19.05,46.99 C11.P$2
N$3
  Top 0.813: U3.P$5 21.59,46.99 C11.P$1
N$4
  Top 0.813: U3.P$3 16.51,46.99 C9.P$1
N$5
  Top 0.813: U3.P$1 11.43,46.99 C9.P$2
N$6
  Bottom 0.813: C10.P$1 12.7,50.8 U3.P$2
N$7
  Top 0.813: U3.P$6 24.13,46.99 C12.P$2
N$8
  Top 0.813: J1.3 U3.P$14
N$9
  Top 0.813: J1.2 19.28,57.38 U3.P$13
N$10  (via drill 0.35)
  Top 0.254: P2.8 30.48,5.08 v30.48,8.51
  Bottom 0.254: v30.48,8.51 31.75,9.78 U10.P$19
N$11
  Top 0.254: U10.P$16 39.37,11.56 37.85,10.03 37.85,2.29 P2.7
N$12
  Top 0.254: U10.P$15 41.91,13.46 38.35,9.91 38.35,2.29 P2.6
N$13
  Top 0.254: P2.5 43.05,2.41 44.96,2.41 45.47,2.92 45.47,4.7 46.35,5.59 47.12,5.59 48.51,6.99 48.51,14.22 U10.P$12
N$14
  Top 0.254: P2.4 45.97,2.79 45.97,4.57 46.48,5.08 47.24,5.08 49.53,7.37 U10.P$9
RESET  (via drill 0.35)
  Top 0.254: U1.39 11.43,25.4 13.97,25.4 v17.91,29.34 | v20.07,31.5 24.38,35.81 29.59,35.81 32.38,33.02 U8.39 38.1,34.29 38.1,36.2 38.73,36.83 41.53,36.83 48.64,43.94 50.8,43.94 51.31,44.45 52.58,44.45 53.34,45.21 53.34,47.24 59.56,53.47 68.07,53.47 73.66,59.05 U4.P$3
  Bottom 0.254: v17.91,29.34 v20.07,31.5
SCR0_CP  (via drill 0.35)
  Top 0.254: v57.78,16.76 57.66,16.89 57.66,50.29 59.82,52.45 68.33,52.45 78.11,62.23 79.25,62.23 80.01,62.99 80.01,67.31 U4.P$8
  Bottom 0.254: U10.P$11 56.26,15.24 v57.78,16.76
TIMER_OUT
  Top 0.254: U6.P$7 38.1,69.72 39.37,68.45 60.45,68.45 64.14,64.77 U2.P$5
UART0_RX  (via drill 0.35)
  Top 0.254: U1.11 26.92,30.23 24,30.23 9.4,30.23 8.38,31.24 6.22,33.4 6.22,37.85 v5.97,38.1 | v5.97,45.72 5.97,47.5 11.56,53.09 19.43,53.09 21.59,55.24 U3.P$12
  Bottom 0.254: v5.97,38.1 v5.97,45.72
UART0_TX  (via drill 0.35)
  Top 0.254: U1.13 26.92,30.73 9.53,30.73 6.73,33.53 6.73,37.85 v6.99,38.1 | v6.99,45.72 6.99,47.88 11.68,52.58 19.56,52.58 U3.P$11
  Bottom 0.254: v6.99,38.1 v6.99,45.72
UART1_RX  (via drill 0.35)
  Top 0.254: U8.11 56.13,36.58 v56.13,10.29 | v54.61,8.76 51.82,5.97 48.77,5.97 46.99,4.19 P1.3
  Bottom 0.254: v56.13,10.29 v54.61,8.76
UART1_TX  (via drill 0.35)
  Top 0.254: U8.13 56.64,38.61 56.64,11.18 v56.77,11.05 | v54.61,7.75 54.23,7.75 50.29,3.81 P1.2
  Bottom 0.254: v56.77,11.05 56.77,9.91 v54.61,7.75
VCC_IO  (via drill 0.35)
  Top 0.813: C8.P$2 C10.P$2 7.62,57.15 U3.P$16 | C2.+ 82.28,30.48 C1.+ 84.82,33.29 C5.P$2 U7.3 | P5.1 86.36,64.9 v82.68,68.58 | U1.44 16.51,20.32 C6.P$2 | U6.P$16 55.12,61.72 55.12,56.64 | 55.12,56.64 U2.P$14 | U5.P$16 55.12,55.12 55.12,56.64 | v53.34,34.29 50.93,34.29 50.42,34.8 | 50.42,34.8 50.42,38.99 U8.14 U8.15 | U1.14 U1.15 v32.89,29.34 | U8.44 45.72,31.75 45.72,33.91 46.61,34.8 50.42,34.8
  Bottom 0.813: P5.1 81.28,49.53 U7.3 | X1.8 61.92,24.58 63.12,25.78 65.91,25.78 | 65.91,25.78 75.04,25.78 C2.+ | v82.68,68.58 71.12,68.58 | 71.12,68.58 U4.P$14 | 55.88,68.58 71.12,68.58 | 55.88,68.58 9.65,68.58 6.35,65.28 C10.P$2 4.45,53.98 4.45,30.73 3.43,29.72 3.43,21.84 4.95,20.32 C6.P$2 C7.P$2 6.86,14.73 28.7,14.73 U10.P$20 | U6.P$16 53.34,66.04 55.88,68.58 | 65.91,25.78 65.66,25.78 C14.P$2 C13.P$2 v53.34,34.29 | v32.89,29.34 34.29,27.94 U11.P$16 | U1.14 19.05,25.4 19.05,22.86 U1.44
VIN
  Top 0.813: 84.39,43.88 Z1.VIN | 84.39,43.88 83.95,44.32 77.98,44.32 76.2,42.55 U7.1 73.66,38.1 | P4.1 84.39,45.02 84.39,43.88 | 73.66,38.1 C4.P$2 | 73.66,38.1 72.66,37.1 C3.+

### Text on the board
tPlace: 74590 | 7400 | 7432 | 74590 | 1uF | 1uF | MAX232N | 1uF | 1uF | 1uF | 7805 | 1uF | 1uF | 16550 | 1uF | 100uF | Rizon I/O | 10uF | 100uF | 16550 | 1uF | 74138 | 18.432 / Mhz | 74273 | RX | TX | GND | IODEV[3..7] | UART1 | SCR0
bPlace: Rizon